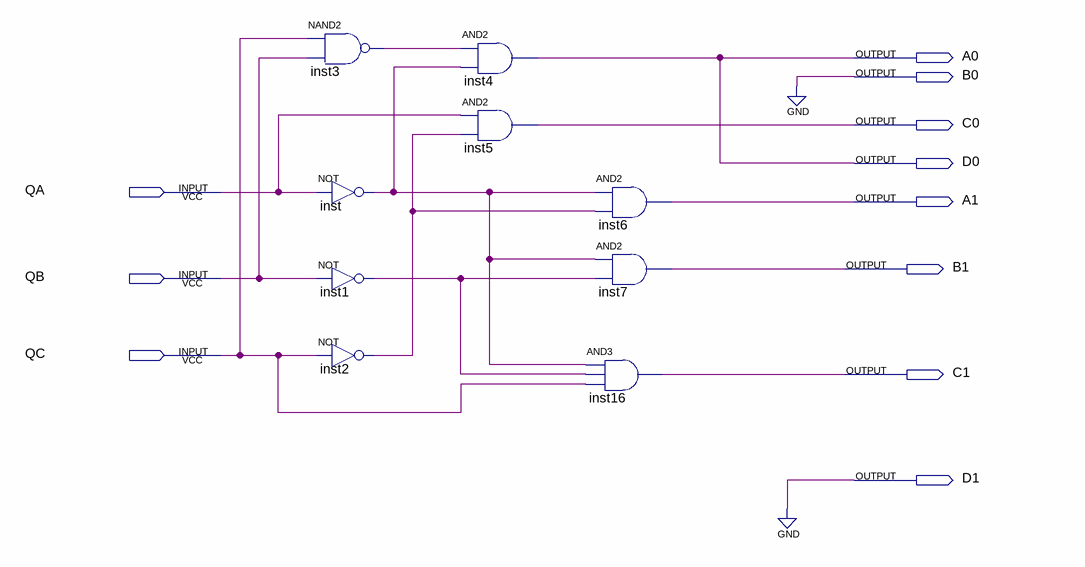
[diagram p0: schematic sheet]
// Quartus schematic Block2.bdf as structural Verilog: 9 symbols, 11 pins
module Block2 (
  input  QA,
  input  QB,
  input  QC,
  output A0,
  output B0,
  output C0,
  output D0,
  output A1,
  output B1,
  output C1,
  output D1
);

  wire inst1_out, inst2_out, inst3_out, inst_out;

  nand inst3 (inst3_out, QC, QB);
  not inst (inst_out, QA);
  not inst1 (inst1_out, QB);
  not inst2 (inst2_out, QC);
  and inst4 (A0, inst3_out, inst_out);
  and inst5 (C0, QA, inst2_out);
  and inst6 (A1, inst_out, inst2_out);
  and inst7 (B1, inst_out, inst1_out);
  and inst16 (C1, inst_out, inst1_out, QC);

  assign B0 = 1'b0;
  assign D0 = A0;
  assign D1 = 1'b0;
endmodule
